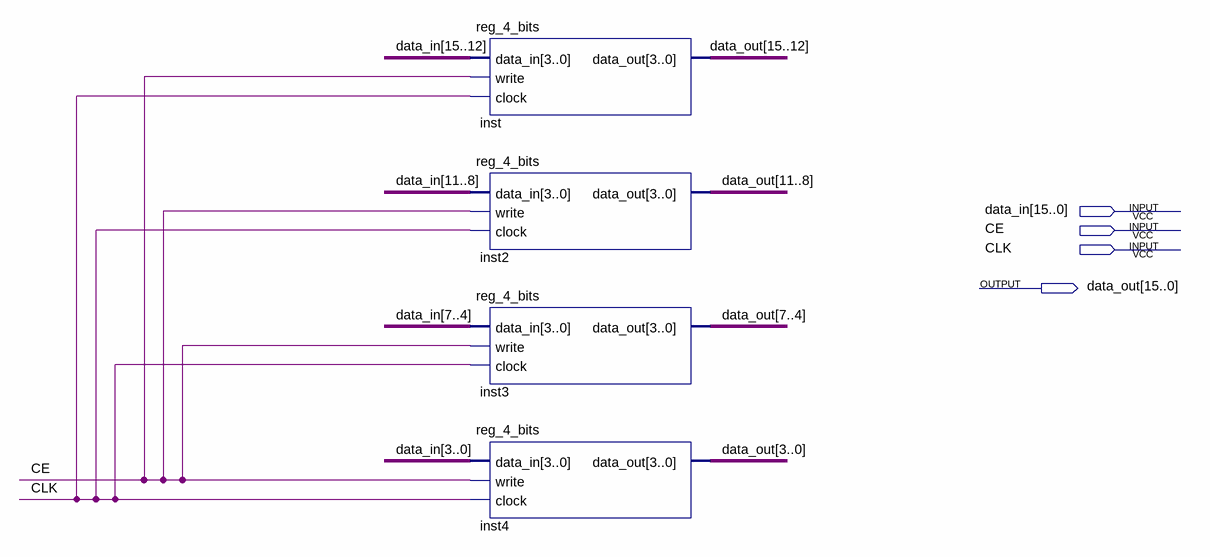
[diagram p0: schematic sheet]
// Quartus schematic reg_16_bits.bdf as structural Verilog: 4 symbols, 4 pins
module reg_16_bits (
  input  [15:0] data_in,
  input  CE,
  input  CLK,
  output [15:0] data_out
);

  reg_4_bits inst (.data_in(data_in[15:12]), .write(CE), .clock(CLK), .data_out(data_out[15:12]));
  reg_4_bits inst2 (.data_in(data_in[11:8]), .write(CE), .clock(CLK), .data_out(data_out[11:8]));
  reg_4_bits inst3 (.data_in(data_in[7:4]), .write(CE), .clock(CLK), .data_out(data_out[7:4]));
  reg_4_bits inst4 (.data_in(data_in[3:0]), .write(CE), .clock(CLK), .data_out(data_out[3:0]));
endmodule
